# EAGLE design mlogger (EAGLE 9.6.2)
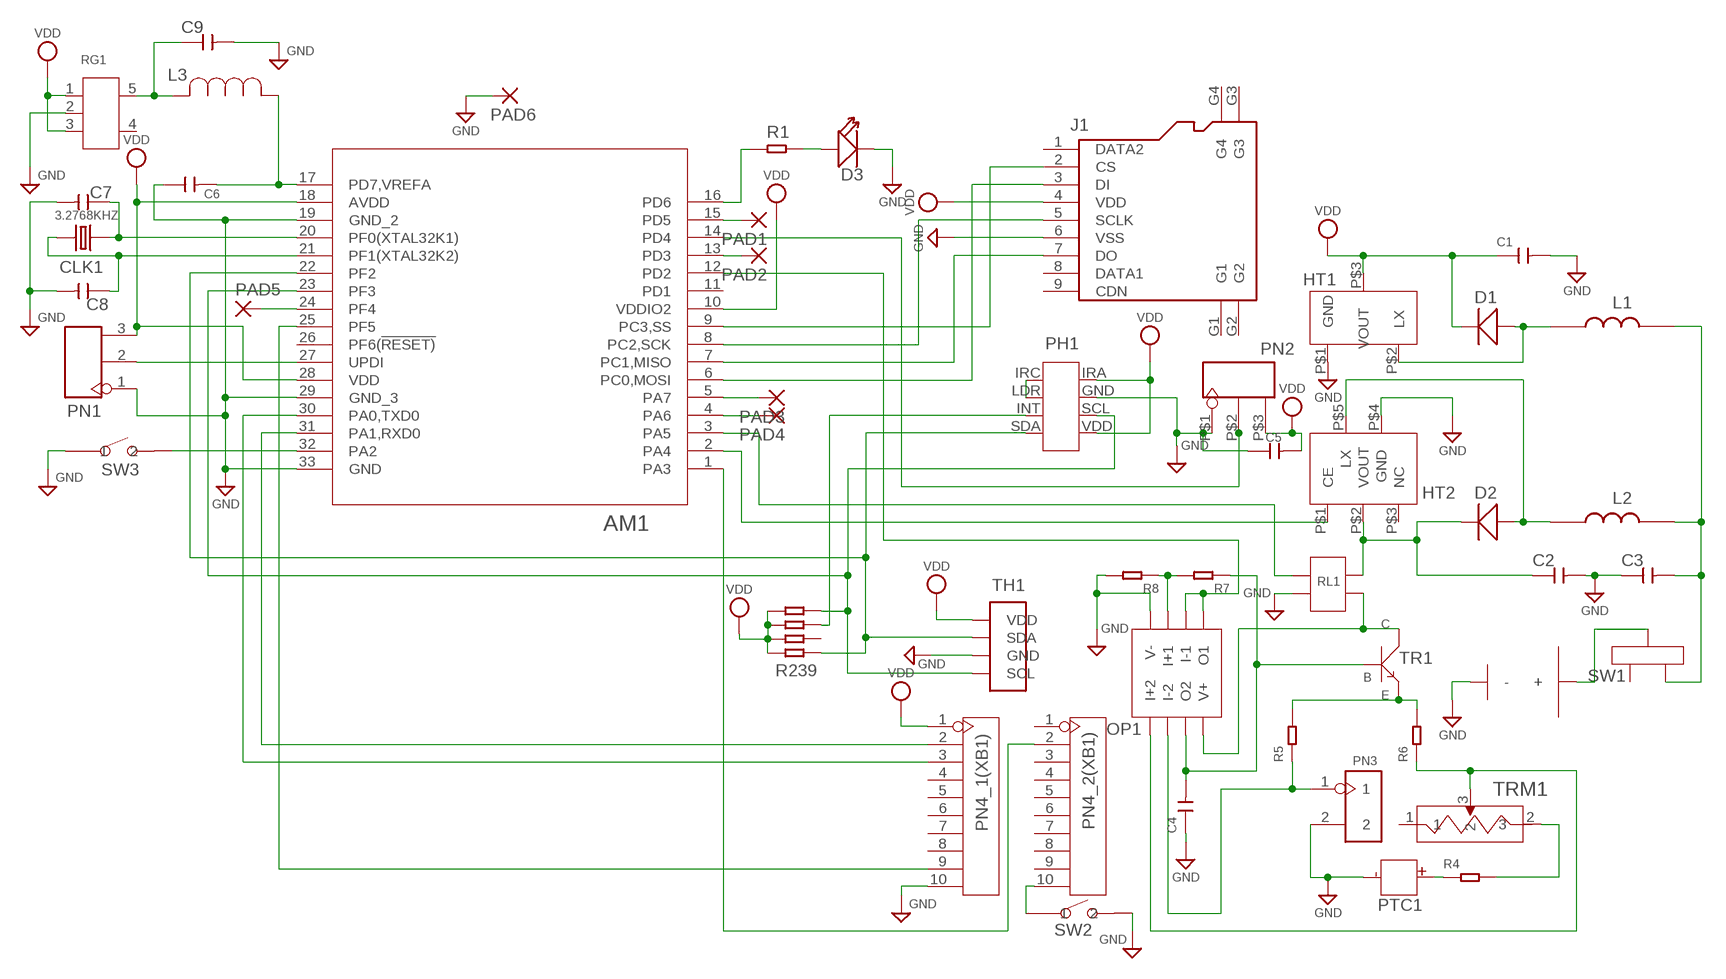
[diagram p0: schematic, sheet 1]

## Parts
AM1  AVR64DB32-I/RXBVQFN32_RXB_MCH  [VQFN32_RXB_MCH]
BB1  BH321  [BH321]
C1  MURATA_0603  [C0603]
C2  MURATA_0603  [C0603]
C3  MURATA_0603  [C0603]
C4  MURATA_0603  [C0603]
C5  MURATA_0603  [C0603]
C6  MURATA_0603  [C0603]
C7  MURATA_0603  [C0603]
C8  MURATA_0603  [C0603]
C9  MURATA_0603  [C0603]
CLK1  3.2768KHZ  SMD-CRYSTAL-32.768KHZ-12.5PF-20PPM-90K(2P-L2.0X1.2MM)  [X2-SMD-L2.0X1.2X0.55MM]
D1  20V-1A  SMD-DIODE-SCHOTTKY-20V-1A(SOD-123)  [SOD-123]
D2  20V-1A  SMD-DIODE-SCHOTTKY-20V-1A(SOD-123)  [SOD-123]
D3  OSHR1608C1A  [C0603]
HT1  HT77XXSOT23  [HT77XXSOT23]
HT2  HT77XXSOT25  [HT77XXSOT25]
J1  MICROSD-9P  MICRO-SD-CARD-HOLDER-9P  [MICRO-SD9+4P-SMD-16.1X14.5X1.85MM]
L1  303010168_47UM_5X5MM  [L2018]
L2  303010168_47UM_5X5MM  [L2018]
L3  LBR2012T100KIND_TAIYO_LBR2012_TAY  [IND_TAIYO_LBR2012_TAY]
OP1  NJM4565  [NJM4565]
PAD1  1,6/0,8  [1,6/0,8]
PAD2  1,6/0,8  [1,6/0,8]
PAD3  1,6/0,8  [1,6/0,8]
PAD4  1,6/0,8  [1,6/0,8]
PAD5  1,6/0,8  [1,6/0,8]
PAD6  1,6/0,8  [1,6/0,8]
PH1  VCNL4030X01  [VCNL4030X01]
PN1  3p-2.54  DIP-BLACK-MALE-HEADER-VERT(3P-2.54)  [H3-2.54]
PN2  B3B-PH-K-S  [B3B-PH-K-S]
PN3  2p-2.54  DIP-BLACK-ROUND-FEMALE-HEADER-VERT(2P-2.54)  [H2-2.54]
PN4_1(XB1)  10p-2.0  DIP-BLACK-FEMALE-HEADER-VERT(10P-2.0)  [H10-2.0]
PN4_2(XB1)  10p-2.0  DIP-BLACK-FEMALE-HEADER-VERT(10P-2.0)  [H10-2.0]
PTC1  TFPT1206  [TFPT1206]
R1  RES_0603  [R0603]
R4  RES_0603  [R0603]
R5  RES_0603  [R0603]
R6  RES_0603  [R0603]
R7  RES_0603  [R0603]
R8  RES_0603  [R0603]
R239  R1005X4  [R1005X4]
RG1  TCR2EF20SOT-25___(SMV)_TOS  [SOT-25___(SMV)_TOS]
RL1  CPC1002N  [CPC1002N]
SW1  SS-12D00G3  [SS-12D00G3]
SW2  TVAF06-A020B-R  [TVAF06-A020B-R]
SW3  TVAF06-A020B-R  [TVAF06-A020B-R]
TH1  AHT20  [AHT20]
TR1  MMBTA42  [MMBTA42]
TRM1  TC33X-1-103EIND_1-103E-L  [IND_1-103E-L]

## Nets
ADC0: AM1.14(PD4) PN2.P$2
ADC2 [PWR]: AM1.12(PD2) OP1.P$1(O1) OP1.P$2(I-1)
CTS: AM1.1(PA3) PN4_2(XB1).2
GADC1: AM1.24(PF4) PAD5.1(P)
GADC2: AM1.15(PD5) PAD1.1(P)
GADC3: AM1.13(PD3) PAD2.1(P)
GND [GND]: AM1.19(GND_2) AM1.29(GND_3) AM1.33(GND) BB1.V-(-) C1.2 C2.2 C3.1 C4.1 C5.1 C6.1 C7.2 C8.2 C9.2 D3.2(-) HT1.P$1(GND) HT2.P$4(GND) J1.6(VSS) OP1.P$4(V-) PAD6.1(P) PH1.GND PN1.1 PN2.P$1 PN3.2 PN4_1(XB1).10 PTC1.P$1 R8.2 RG1.2 RL1.GND SW2.P$2 SW3.P$1 TH1.P$5(GND)
INT: PH1.INT R239.4
MISO: AM1.7(PC1,MISO) J1.7(DO)
MOSI: AM1.6(PC0,MOSI) J1.3(DI)
N$1: R4.2 TRM1.2
N$2: AM1.20(PF0(XTAL32K1)) C7.1 CLK1.1
N$3: PN4_2(XB1).10 SW2.P$1
N$4: AM1.16(PD6) R1.2
N$5: AM1.32(PA2) SW3.P$2
N$6: AM1.21(PF1(XTAL32K2)) C8.1 CLK1.2
N$7: C9.1 L3.2 RG1.5
N$10: D3.1(+) R1.1
N$12: AM1.5(PA7) PAD3.1(P)
N$13: AM1.4(PA6) PAD4.1(P)
N$14: BB1.V+(+) SW1.P$1(P2)
N$20: PH1.IRC PH1.LDR
N$23: AM1.2(PA4) HT2.P$1(CE)
N$24: AM1.3(PA5) RL1.+
N$28: PTC1.P$2 R4.1
P$1 [PWR]: OP1.P$6(I-2) PN3.1 R5.1
P$2 [PWR]: R5.2 R6.2 TR1.P$2
P$3 [PWR]: OP1.P$5(I+2) R6.1 TRM1.3
P$5 [PWR]: C4.2 OP1.P$7(O2) R7.1 TR1.P$1
P$6 [PWR]: OP1.P$8(V+) RL1.DC- TR1.P$3(C)
P$7 [PWR]: OP1.P$3(I+1) R7.2 R8.1
P$10 [PWR]: D2.+ HT2.P$5(LX) L2.P$1
P$11 [PWR]: C3.2 L1.P$2 L2.P$2 SW1.P$2(P1)
P$13 [PWR]: D1.+ HT1.P$2(LX) L1.P$1
RXD: AM1.31(PA1,RXD0) PN4_1(XB1).2
SCK: AM1.8(PC2,SCK) J1.5(SCLK)
SCL: AM1.23(PF3) PH1.SCL R239.2 TH1.P$3(SCL)
SDA [PWR]: AM1.22(PF2) PH1.SDA R239.8 TH1.P$4(SDA)
SLP: AM1.25(PF5) PN4_1(XB1).9
SS: AM1.9(PC3,SS) J1.2(CS)
TXD: AM1.30(PA0,TXD0) PN4_1(XB1).3
UPDI: AM1.27(UPDI) PN1.2
V5 [PWR]: C2.1 D2.- HT2.P$2(VOUT) RL1.DC+
VDD [PWR]: AM1.10(VDDIO2) AM1.18(AVDD) AM1.28(VDD) C1.1 C5.2 D1.- HT1.P$3(VOUT) J1.4(VDD) PH1.IRA PH1.VDD PN1.3 PN2.P$3 PN4_1(XB1).1 R239.1 R239.3 R239.5 R239.7 RG1.1 RG1.3 TH1.P$2(VDD)
VREFA: AM1.17(PD7,VREFA) C6.2 L3.1
Unconnected: AM1.11(PD1) AM1.26(PF6(!RESET)) HT2.P$3(NC) J1.1(DATA2) J1.8(DATA1) J1.9(CDN) J1.G1 J1.G2 J1.G3 J1.G4 PN4_1(XB1).4 PN4_1(XB1).5 PN4_1(XB1).6 PN4_1(XB1).7 PN4_1(XB1).8 PN4_2(XB1).1 PN4_2(XB1).3 PN4_2(XB1).4 PN4_2(XB1).5 PN4_2(XB1).6 PN4_2(XB1).7 PN4_2(XB1).8 PN4_2(XB1).9 R239.6 RG1.4 SW1.P$3(P3) TRM1.1

## Notes on the sheet
- PH1
- TH1

## Library data of the parts
AM1 = MyParts:AVR64DB32-I/RXB; COPYRIGHT: Copyright (C) 2022 Ultra Librarian. All rights reserved.; MANUFACTURER_PART_NUMBER: AVR64DB32-I/RXB; MFR_NAME: Microchip
BB1 = MyParts:BH321
C1-C9 = MyParts:MURATA_0603
CLK1 = Seeed-Crystal Oscillator:SMD-CRYSTAL-32.768KHZ-12.5PF-20PPM-90K(2P-L2.0X1.2MM): 306010020; MPN: FC-12M
D1 D2 = Seeed-Diode:SMD-DIODE-SCHOTTKY-20V-1A(SOD-123): 304020034; MPN: B5819W
D3 = MyParts:OSHR1608C1A
HT1 = MyParts:HT77XXSOT23
HT2 = MyParts:HT77XXSOT25
J1 = OPL_Connector:MICRO-SD-CARD-HOLDER-9P: 320090008
L1 L2 = Seeed-OPL-2017-01-Inductor-Akita:303010168_47UM_5X5MM: SPD4D28-470M, SMD Inductor 47uH-±20%-450mA;4.8*4.8*3.2mm, SKU: 303010168
L3 = MyParts:LBR2012T100K
OP1 = MyParts:NJM4565
PAD1-PAD6 = wirepad:1,6/0,8: THROUGH-HOLE PAD
PH1 = MyParts:VCNL4030X01
PN1 = MyParts:DIP-BLACK-MALE-HEADER-VERT(3P-2.54): 320020079
PN2 = MyParts:B3B-PH-K-S
PN3 = MyParts:DIP-BLACK-ROUND-FEMALE-HEADER-VERT(2P-2.54): 320030050; MPN: RF130-1023ABS0741
PN4_1(XB1) PN4_2(XB1) = OPL_Connector:DIP-BLACK-FEMALE-HEADER-VERT(10P-2.0): 320030009; MPN: F243-1110A1BSUA1
PTC1 = MyParts:TFPT1206
R1 R4-R8 = MyParts:RES_0603: 301012041
R239 = MyParts:R1005X4
RG1 = MyParts:TCR2EF20
RL1 = MyParts:CPC1002N
SW1 = MyParts:SS-12D00G3
SW2 SW3 = MyParts:TVAF06-A020B-R
TH1 = MyParts:AHT20
TR1 = MyParts:MMBTA42
TRM1 = MyParts:TC33X-1-103E

## Net classes
0 default: width 0.254 mm
1 GND: width 0.254 mm
2 PWR: width 0.254 mm

## Board
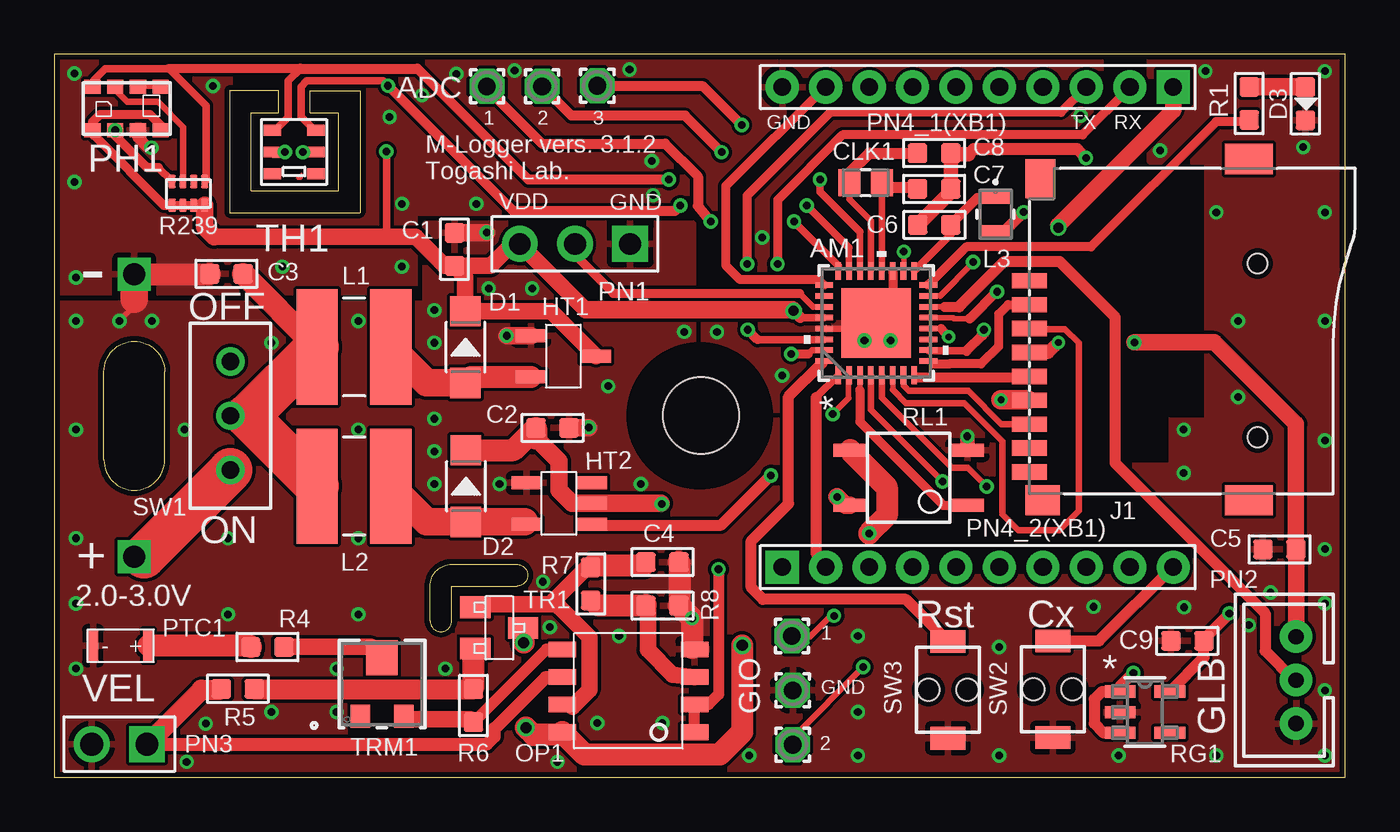
[diagram p1: board, top side]
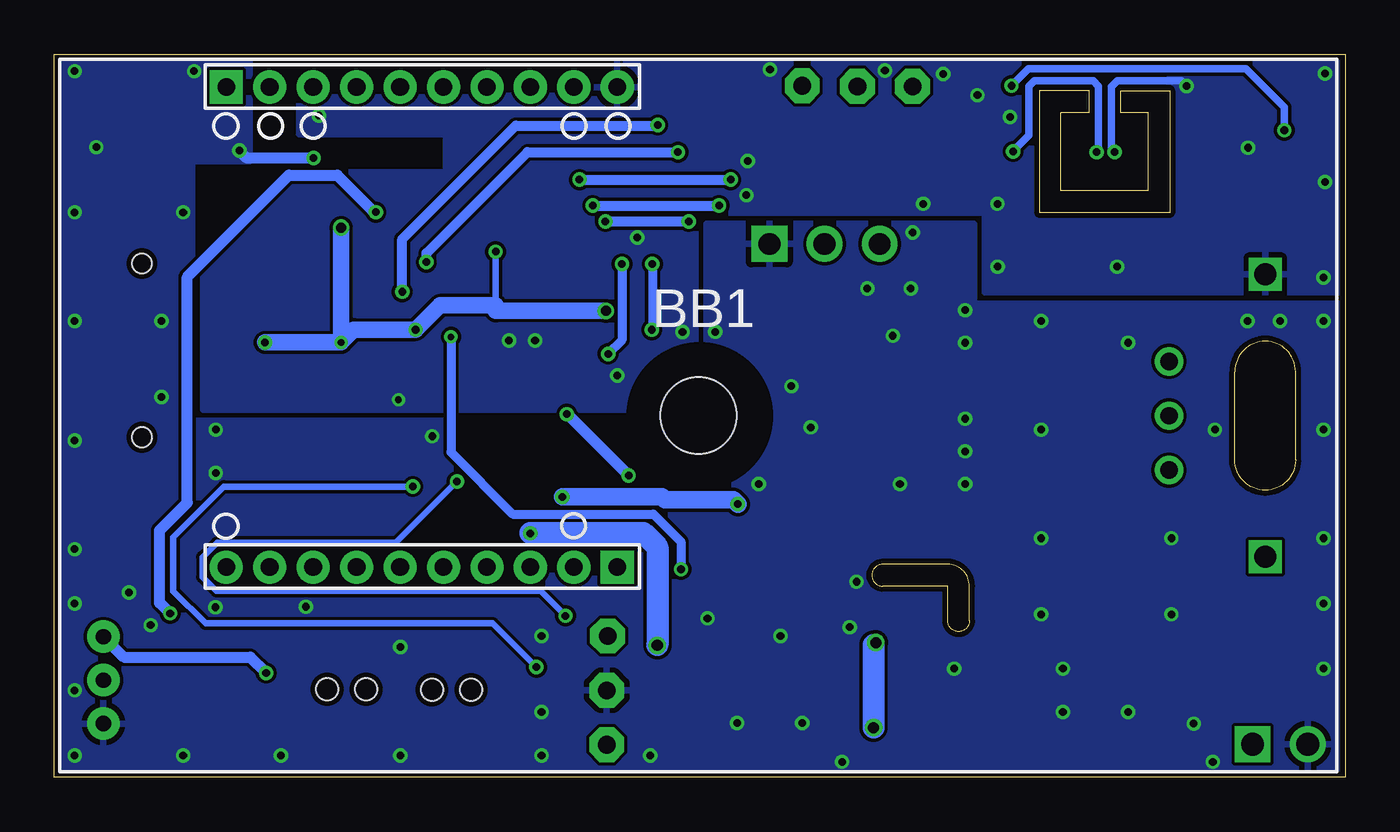
[diagram p2: board, bottom side, seen from below]

Size 59.44 x 33.27 mm. Coordinates in mm from the lower left corner, seen from the top.
Outline: 0,0 59.44,0 59.44,33.27 0,33.27 0,0
Outline: 8.08,31.6 8.08,25.98 14.07,25.98 14.07,31.6 11.79,31.6 11.79,30.58 13.08,30.58 13.08,27 9.07,27 9.07,30.58 10.34,30.58 10.34,31.6 8.08,31.6
Outline: 2.29,14.61 2.29,18.67 arc-180 5.08,18.67 5.08,14.61 arc-180 2.29,14.61
Outline: 17.3,8.8 arc-90 18.3,9.8 21.3,9.8 arc-180 21.3,8.8 18.3,8.8 18.3,7.2 arc-180 17.3,7.2 17.3,8.8
Copper layers (1*16): Top 0.035mm / dielectric 1.5mm / Bottom 0.035mm
Design rules "SeeedStudio_2layer_DRU_no_angle_20140221 *": minimum track width 6mil, minimum drill 12mil, track to track 6mil, track to pad 6mil, pad to pad 6mil, via to via 6mil, smd to smd 0mil, copper to edge 10mil, drill to drill 10mil, minimum pad ring 10mil, minimum via ring 6mil, stop-mask expansion 2mil, vias tented up to drill 30mil, thermal gap 10mil
tRestrict: area 26.4,13.3 to 33,19.9
bRestrict: area 26.4,13.3 to 33,19.9

### Footprints (pad centres in the part's own frame; a part is rotated, then mirrored left to right if it is on the bottom)
VQFN32_RXB_MCH = smd 0.813 x 0.254: 1 -2.4,1.75; 2 -2.4,1.25; 3 -2.4,0.75; 4 -2.4,0.25; 5 -2.4,-0.25; 6 -2.4,-0.75; 7 -2.4,-1.25; 8 -2.4,-1.75; 17 2.4,-1.75; 18 2.4,-1.25; 19 2.4,-0.75; 20 2.4,-0.25; 21 2.4,0.25; 22 2.4,0.75; 23 2.4,1.25; 24 2.4,1.75 | smd 0.254 x 0.813: 9 -1.75,-2.4; 10 -1.25,-2.4; 11 -0.75,-2.4; 12 -0.25,-2.4; 13 0.25,-2.4; 14 0.75,-2.4; 15 1.25,-2.4; 16 1.75,-2.4; 25 1.75,2.4; 26 1.25,2.4; 27 0.75,2.4; 28 0.25,2.4; 29 -0.25,2.4; 30 -0.75,2.4; 31 -1.25,2.4; 32 -1.75,2.4 | smd 3.2 x 3.2: 33 0,0
BH321 = drill 1 square: V+ 55.5,9.9; V- 55.5,22.9 | hole 3.5: 29.4,16.4
C0603 = smd 0.889 x 0.889: 1 0,0.762; 2 0,-0.762
X2-SMD-L2.0X1.2X0.55MM = smd 1 x 1.25: 1 -0.75,0; 2 0.75,0
SOD-123 = smd 1.397 x 1.397: + -1.651,0; - 1.651,0
HT77XXSOT23 = smd 0.6 x 1.4: P$1 0,-0.5; P$2 1.9,-0.5; P$3 0.95,2.5
HT77XXSOT25 = smd 0.6 x 1.4: P$1 0,-0.5; P$2 0.95,-0.5; P$3 1.9,-0.5; P$4 1.9,2.5; P$5 0,2.5
MICRO-SD9+4P-SMD-16.1X14.5X1.85MM = smd 1.6 x 0.7: 1 0,2.25; 2 0,1.15; 3 0,0.05; 4 0,-1.05; 5 0,-2.15; 6 0,-3.25; 7 0,-4.35; 8 0,-5.45; 9 0,-6.55 | smd 1.6 x 1.4: G1 0.6,-7.85 | smd 2.2 x 1.4: G2 10.1,-7.85; G3 10.1,7.85 | smd 1.4 x 1.8: G4 0.5,6.95 | hole 0.9: 10.5,-4.95; 10.5,3.05
L2018 = smd 1.9 x 5.3: P$1 -1.7,0; P$2 1.7,0
IND_TAIYO_LBR2012_TAY = smd 0.61 x 1.448: 1 -0.8,0; 2 0.8,0
NJM4565 = smd 0.72 x 1.27: P$1 0,0; P$2 1.27,0; P$3 2.54,0; P$4 3.81,0; P$5 3.81,6.1; P$6 2.54,6.1; P$7 1.27,6.1; P$8 0,6.1
1,6/0,8 = drill 0.813 pad 1.6 octagon: 1 0,0
VCNL4030X01 = smd 0.75 x 0.65: GND -0.525,1.005; INT 0.525,-1.005; IRA -1.575,1.005; IRC -1.575,-1.005; LDR -0.525,-1.005; SCL 0.525,1.005; SDA 1.575,-1.005; VDD 1.575,1.005
H3-2.54 = drill 1 pad 1.651 square: 1 0,2.54 | drill 1 pad 1.651: 2 0,0; 3 0,-2.54
B3B-PH-K-S = drill 0.7 pad 1.5: P$1 -2,0; P$2 0,0; P$3 2,0
H2-2.54 = drill 1.05 pad 1.651 square: 1 0,1.27 | drill 1.05 pad 1.651: 2 0,-1.27
H10-2.0 = drill 0.813 pad 1.524 square: 1 0,9 | drill 0.813 pad 1.524: 2 0,7; 3 0,5; 4 0,3; 5 0,1; 6 0,-1; 7 0,-3; 8 0,-5; 9 0,-7; 10 0,-9
TFPT1206 = smd 0.5 x 1.5: P$1 0,0; P$2 2.55,0
R0603 = smd 0.889 x 0.889: 1 0,0.762; 2 0,-0.762
R1005X4 = smd 0.33 x 0.6: 1 -0.75,-0.55; 2 -0.75,0.55; 3 -0.25,-0.55; 4 -0.25,0.55; 5 0.25,-0.55; 6 0.25,0.55; 7 0.75,-0.55; 8 0.75,0.55
SOT-25___(SMV)_TOS = smd 1.422 x 0.559: 1 -1.144,0.95; 2 -1.144,0; 3 -1.144,-0.95; 4 1.144,-0.95; 5 1.144,0.95
CPC1002N = smd 0.6 x 1.54: + -1.27,-2.7; DC+ -1.27,2.7; DC- 1.27,2.7; GND 1.27,-2.7
SS-12D00G3 = drill 0.8: P$1 -2.5,0; P$2 0,0; P$3 2.5,0
TVAF06-A020B-R = smd 1.05 x 1.6: P$1 -2.225,0; P$2 2.225,0 | hole 1: 0,0.9; 0,-0.9
AHT20 = smd 0.8 x 0.5: P$1 0,2; P$2 0,1; P$3 0,0; P$4 2,0; P$5 2,1; P$6 2,2
MMBTA42 = smd 1 x 1.4: P$1 0,0; P$2 1.9,0; P$3 0.95,2.2
IND_1-103E-L = smd 0.889 x 1.041: 1 -1,-1.486; 3 1,-1.486 | smd 1.448 x 1.6: 2 0,1.206

### Placement (x,y rotation side)
AM1  37.85,20.9 90 top
BB1  59.18,0.25 0 bottom
C1  18.42,24.3 180 top
C2  22.94,16.08 90 top
C3  7.93,23.17 90 top
C4  28,9.9 270 top
C5  56.41,10.49 90 top
C6  40.52,25.43 90 top
C7  40.51,27.08 90 top
C8  40.51,28.73 90 top
C9  52.17,6.27 270 top
CLK1  37.36,27.36 180 top
D1  18.93,19.8 90 top
D2  18.95,13.4 90 top
D3  57.6,31 0 top
HT1  22.44,20.33 270 top
HT2  24.24,11.65 90 top
J1  44.9,20.6 0 top
L1  13.8,19.8 180 top
L2  13.8,13.4 180 top
L3  43.33,25.91 270 top
OP1  29.48,2.07 90 top
PAD1  22.46,31.8 0 top
PAD2  25,31.83 0 top
PAD3  34,1.5 0 top
PAD4  33.96,6.5 0 top
PAD5  19.92,31.8 0 top
PAD6  34,4 0 top
PH1  3.33,30.78 180 top
PN1  23.97,24.55 270 top
PN2  57.18,4.47 90 top
PN3  2.99,1.52 270 top
PN4_1(XB1)  42.52,31.77 270 top
PN4_2(XB1)  42.52,9.67 90 top
PTC1  1.78,6.05 0 top
R1  55.02,31.01 0 top
R4  9.81,6 90 top
R5  8.45,4.07 90 top
R6  19.3,3.3 180 top
R7  24.7,8.9 0 top
R8  28,7.9 90 top
R239  6.17,26.87 0 top
RG1  50.22,3 0 top
RL1  39.33,13.78 90 top
SW1  8.11,16.64 90 top
SW2  45.97,4.05 270 top
SW3  41.15,4.03 90 top
TH1  12.04,29.78 180 top
TR1  19.38,7.83 270 top
TRM1  15.09,4.29 0 top

### Tracks (layer width: path | path; a pad name or v marks a point on that pad's centre or on a via)
ADC0
  Top 0.254: AM1.14 40.99,21.65 | 57.1,4.47 PN2.P$2
  Top 0.457: 40.99,21.65 41.65,21.65
  Top 0.508: 41.65,21.65 43.76,23.75 46.28,23.75 48.84,21.18 48.84,14.45 55.75,7.54 55.75,5.82 57.1,4.47
ADC2  (via drill 0.3, 0.35)
  Top 0.254: 40.84,20.65 AM1.12 | OP1.P$2 29.49,3.35 30.12,3.35
  Top 0.406: v41.17,20.27 40.84,20.65
  Top 0.508: v30.58,9.58 30.58,3.81 30.12,3.35 | OP1.P$1 OP1.P$2
  Bottom 0.406: v41.17,20.27 41.17,14.96 38.33,12.12 31.85,12.12 30.58,10.85 v30.58,9.58
CTS
  Top 0.356: 35.08,17.48 AM1.1
  Top 0.508: 35.08,17.48 35.08,10.3 PN4_2(XB1).2
GADC1  (via drill 0.35)
  Top 0.254: 36.1,23.54 AM1.24
  Top 0.356: v34.06,25.58 36.1,23.54
  Top 0.457: v30.23,25.58 29.64,26.3 29.64,27.65 28.12,29.16 22.45,29.16 19.92,31.7 PAD5.1
  Bottom 0.457: v30.23,25.58 v34.06,25.58
GADC2  (via drill 0.35)
  Top 0.254: AM1.15 40.26,22.17 40.79,22.17
  Top 0.305: v42.3,23.71 42.3,23.68 40.79,22.17
  Top 0.457: v30.72,28.77 29.04,30.45 23.81,30.45 PAD1.1
  Bottom 0.457: v42.3,23.71 42.3,24.12 37.66,28.77 v30.72,28.77
GADC3  (via drill 0.35)
  Top 0.254: 42.15,21.11 41.43,21.11 41.41,21.14 40.78,21.14 40.76,21.15 AM1.13 | v43.41,22.35 43.4,22.36
  Top 0.457: 43.4,22.36 42.15,21.11 | v31.65,30.02 29.87,31.8 25.02,31.8 PAD2.1
  Bottom 0.457: v43.41,22.35 43.41,24.77 38.19,30 31.67,30 v31.65,30.02
GND  (via drill 0.3, 0.35)
  Top 0.254: 29.36,5.96 OP1.P$4 | 28.85,7.82 R8.2 | AM1.29 | 38.61,21.64 37.9,20.93 AM1.33 | 44.81,17.37 J1.6 | AM1.19 38.61,23.27 | 41.27,26.94 C7.2 | 41.33,28.68 C8.2 | AM1.33 37.85,20.88 37.62,20.65 | AM1.33 37.3,20.36 v37.3,20.1 | 24.59,16.08 v24.61,16.1 | v20.84,20.33 v20.83,20.32 | 3.68,22 3.68,21.68 v3,21
  Top 0.305: 37.62,20.65 AM1.29
  Top 0.406: 38.61,23.27 38.61,21.64
  Top 0.508: v4.47,28.98 4.33,28.98 3.85,29.45 PH1.GND | TH1.P$5 v10.62,28.78 | 42.09,28.68 42.32,28.91 | 47.09,28.91 v47.5,28.5
  Top 0.559: 47.09,28.91 42.32,28.91
  Top 0.66: v42.04,15.7 RL1.GND | C6.1 41.27,26.94 | C7.2 C8.2 | 41.33,28.68 42.09,28.68
  Top 0.813: C2.2 24.59,16.08 | HT1.P$1 v20.84,20.33 | C1.2 18.43,25.07 v19.91,25.07
  Top 0.889: v43.59,17.37 44.81,17.37
  Top 1.016: C4.1 28.78,9.88 28.78,7.92 R8.2 | 29.36,5.96 v29.36,7.32 28.85,7.82 | C3.1 7.16,23.15 BB1.V-
  Top 1.27: BB1.V- 3.68,22
  Bottom 0.254: 50.52,28.5 50.58,28.5 | v7.31,31.82 7.54,32.05
  Bottom 0.356: v10.62,28.78 10.77,28.93 10.77,31.78 10.5,32.05 7.54,32.05
  Bottom 0.508: v47.5,28.5 50.52,28.5 | 50.58,28.5 v50.92,28.84
  other vias: 22.81,6.91 38.5,20.1 6.1,0.71 23.16,0.71 1,23 14,21 14,16 14,11 8,11 1,11 1,16 1,21 6,16 13,5 13,3 6.97,2.47 18,5 8,7.5 14,7.5 1,8 1,5 10,3 25,2.5 26,6.5 28,2.5 29,20.5 20,22.5 22,22.5 27,13.5 25.5,18 17.5,20 17.5,21.5 16,23.5 10.5,23.5 17.5,16.5 17.5,13.5 17.5,15 20.5,13.5 32,1 22.5,9 58.5,1 58.5,4 58.5,8 58.5,15.5 58.5,10.5 52,16 58.5,26 58.5,21 53.5,26 58.5,32.5 53,32.5 47.25,30.45 32.6,24.84 33.51,18.49 30.51,20.49 26.48,32.57 21.19,32.53 27.51,28.37 18.51,32.37 16.93,31.39 27.57,26.79 16.01,26.39 15.43,30.39 19.43,26.39 0.93,32.39 0.93,27.39 4.5,21 10,20 54.5,21 52,14 54.5,17.5 56,8.5 37,6.5 37,3 37,1 49,1 47.85,7.85 52.02,7.82 43.5,6 43.5,1 53.5,1 57.5,29 55,7
  pour Bottom: 0,21.79 17.09,21.79 17.09,25.48 29.41,25.48 29.41,16.41 53.09,16.41 53.09,28.35 50.44,28.35 50.44,33.27 59.44,33.27 59.44,0 0,0
  pour Top: 0,21.79 17.09,21.79 17.09,25.48 29.41,25.48 29.41,16.41 53.09,16.41 53.09,28.35 50.44,28.35 50.44,33.27 59.44,33.27 59.44,0 0,0
  pour Bottom: 0,33.27 0,22.33 16.59,22.33 16.59,25.98 29.92,25.98 29.92,16.92 52.58,16.92 52.58,27.84 41.4,27.84 41.4,29.59 48.16,29.59 48.16,33.27 14.07,33.27 14.07,25.98 8.08,25.98 8.08,33.27
  pour Top: 0,33.27 0,22.33 16.59,22.33 16.59,25.98 29.92,25.98 29.92,16.92 36.25,16.92 36.25,29.59 48.16,29.59 48.16,33.27 14.07,33.27 14.07,25.98 8.08,25.98 8.08,33.27
INT
  Top 0.254: 5.94,27.45 R239.4 | 2.93,31.51 PH1.INT
  Top 0.305: 5.94,27.45 5.94,29.92 4.78,31.09 3.35,31.09 2.93,31.51
MISO
  Top 0.254: 39.12,18.01 39.12,18.49 AM1.7 | J1.7
  Top 0.305: 39.12,18.01 39.34,17.78 42.08,17.78 43.62,16.24 J1.7
MOSI
  Top 0.254: 38.61,17.83 AM1.6 | 44.91,20.62 J1.3
  Top 0.305: 38.61,17.83 39.22,17.22 41.91,17.22 43.66,15.47 43.66,12.12 44.4,11.38 46.28,11.38 47.17,12.27 47.17,19.99 46.53,20.62 44.91,20.62
N$1
  Top 0.762: R4.2 14.59,6 TRM1.2
N$2
  Top 0.254: 38.1,23.37 AM1.20 | 39.69,27.13 C7.1
  Top 0.305: CLK1.1 38.1,23.37
  Top 0.508: 39.69,27.13 38.34,27.13 CLK1.1
N$3
  Top 0.254: 51.5,9.67 PN4_2(XB1).10
  Top 0.508: 51.5,9.67 48.1,6.28 SW2.P$1
N$4
  Top 0.254: 54.97,30.18 R1.2
  Top 0.406: AM1.16 40.25,22.67 41.99,24.41 47.73,24.41 53.49,30.18 54.97,30.18
N$5
  Top 0.254: 35.36,19.1 AM1.32
  Top 0.406: 35.36,19.07 35.36,19.1
  Top 0.508: 35.36,19.07 33.81,17.53 33.81,12.6 32.08,10.87 32.08,8.74 32.63,8.19 39.21,8.19 SW3.P$2
N$6
  Top 0.254: 37.59,23.37 AM1.21
  Top 0.305: 37.59,23.37 37.59,25.61 36.61,26.6 CLK1.2 36.61,27.81
  Top 0.508: 36.61,27.81 37.52,28.73 C8.1
N$7  (via drill 0.35)
  Top 0.254: 43.73,25.11 L3.2 | C9.1 52.93,6.36
  Top 0.508: v44.63,26.01 43.73,25.11 | v54.1,7.54 54.1,7.53 52.93,6.36 | RG1.5 52.93,5.52 C9.1
  Bottom 0.254: v54.1,7.54 v54.11,7.54 | v44.63,26.01 44.71,26.01
  Bottom 0.508: v54.11,7.54 54.59,8.02 54.59,11.37 53.31,12.64 53.31,23.03 48.63,27.71 46.41,27.71 44.71,26.01
N$10
  Top 0.254: 57.57,31.77 D3.1
  Top 0.813: R1.1 57.57,31.77
N$12  (via drill 0.35)
  Top 0.254: AM1.5
  Top 0.305: AM1.5 38.1,17.47 41.32,14.25 42.06,14.25 v42.93,13.39 | PAD3.1 34,1.83 v37.24,5.07
  Bottom 0.305: v37.24,5.07 39.25,7.08 52.47,7.08 53.95,8.56 53.95,11.06 51.63,13.38 42.99,13.38 42.99,13.39 v42.93,13.39
N$13  (via drill 0.35)
  Top 0.305: AM1.4 37.6,16.91 v40.89,13.61 | v35.9,7.43 35.75,7.43 34.82,6.5 PAD4.1
  Bottom 0.305: v40.89,13.61 43.72,10.79 51.95,10.79 52.61,10.13 52.61,9.21 51.97,8.58 37.05,8.58 v35.9,7.43
N$14
  Top 1.27: BB1.V+ 4.13,10.15
  Top 2.032: 4.13,10.15 SW1.P$1
N$20
  Top 0.254: PH1.LDR 3.86,31.8 4.88,31.8 PH1.IRC
N$23  (via drill 0.35)
  Top 0.254: AM1.2 36.57,18.48 36.57,17.44 | HT2.P$1 24.8,11.6
  Top 0.305: v35.84,16.71 36.57,17.44
  Top 0.508: 24.8,11.6 30.7,11.6 v32.99,13.89
  Bottom 0.508: v35.84,16.71 35.81,16.71 v32.99,13.89
N$24
  Top 0.254: AM1.3 37.1,17.84 37.08,17.83
  Top 0.406: RL1.+ 40.93,12.51 37.08,16.36 37.08,17.83
N$28
  Top 1.016: R4.1 8.99,6.05 PTC1.P$2
P$1
  Top 0.254: 7.68,4.04 R5.1 | PN3.1 | 23.37,4.6 OP1.P$6
  Top 0.61: 23.37,4.6 22.63,4.6 20.27,2.23 20.27,1.88 19.91,1.52 PN3.1
  Top 0.914: 7.68,4.04 6.78,4.04 PN3.1
P$2
  Top 0.254: R5.2 9.25,4.04 | 19.3,5.89 TR1.P$2 | 19.3,4.17 R6.2
  Top 0.762: R6.2 19.28,4.04
  Top 0.914: 19.28,4.04 9.25,4.04
  Top 1.016: 19.3,4.17 19.3,5.89
P$3
  Top 0.254: R6.1 | TRM1.3 16.23,2.67
  Top 0.508: OP1.P$5 23.37,5.89 22.66,5.89 R6.1
  Top 0.762: R6.1 19.17,2.67 16.23,2.67
P$5
  Top 0.254: 27.13,9.75 27.23,9.86 C4.2 | 23.85,3.25 23.4,3.25 OP1.P$7 | 23.26,7.83 23.02,7.83 23.02,7.95 23.02,8.15 | R7.1 24.79,9.75
  Top 0.762: 23.85,3.25 24.64,4.04 24.64,6.45 23.26,7.83 | 23.02,7.95 19.51,7.95 TR1.P$1 | R7.1 24.52,9.66 23.02,8.15
  Top 1.016: 24.79,9.75 27.13,9.75
P$6  (via drill 0.35, 0.51)
  Top 0.254: 21.61,6.84 TR1.P$3
  Top 0.813: OP1.P$8 23.25,1.95
  Top 1.016: v31.67,6.07 31.67,2.08 30.63,1.04 24.41,1.04 OP1.P$8 | 23.25,1.95 22.06,1.95 v21.72,2.29 | v21.61,6.2 21.61,6.84 | RL1.DC- 38.33,13.36 38.33,12.04 v37.52,11.23
  Bottom 0.254: v31.67,6.07 31.66,6.08 | v37.52,11.23 37.52,11.24
  Bottom 0.813: v21.61,6.2 21.72,6.1
  Bottom 1.016: 21.72,6.1 v21.72,2.29 | 31.66,6.08 31.66,10.6 32.31,11.24 37.52,11.24
P$7
  Top 0.254: 24.99,7.92 24.79,8.13 R7.2 | 27.23,7.92 R8.1 27.33,7.82
  Top 0.762: 27.33,7.82 27.33,5.87 28.47,4.72 OP1.P$3
  Top 1.016: 24.99,7.92 27.23,7.92
P$10
  Top 0.254: 21.65,11.75 HT2.P$5
  Top 1.27: 21.65,11.75 D2.+ 17.15,11.75 L2.P$1
P$11
  Top 0.254: SW1.P$2 8.86,16.64
  Top 1.016: L1.P$2 12.04,19.82 C3.2
  Top 1.27: SW1.P$2 8.94,16.64
  Top 2.032: 8.86,16.64 L2.P$2 | 8.94,16.64 L1.P$2
P$13
  Top 0.254: D1.+ 19.21,18.43
  Top 1.016: 19.21,18.43 HT1.P$2
  Top 1.27: L1.P$1 17.15,18.15 D1.+
RXD  (via drill 0.35)
  Top 0.254: 49.48,31.7 PN4_1(XB1).2
  Top 0.305: 34.72,19.48 34.89,19.65 AM1.31
  Top 0.406: 49.48,31.7 47.35,29.57 36.3,29.57 33.3,26.57 v33.3,23.62 | v33.93,19.48 34.72,19.48
  Bottom 0.406: v33.3,23.62 33.3,20.12 v33.93,19.48
SCK
  Top 0.254: 39.62,18.49 AM1.8 | 44.81,18.39 J1.5
  Top 0.356: 39.73,18.39 39.62,18.49
  Top 0.457: 44.81,18.39 39.73,18.39
SCL  (via drill 0.35)
  Top 0.254: 2.8,29.53 PH1.SCL | 11.98,29.78 TH1.P$3
  Top 0.305: 36.6,24.36 AM1.23
  Top 0.356: v15.37,31.83 15.14,32.05 11.63,32.05 11.35,31.78 11.35,30.4 11.98,29.78 | 36.6,24.36 v34.65,26.31 | R239.2 4.79,28.05
  Top 0.406: 4.79,28.05 4.28,28.05 2.8,29.53
  Top 0.457: v15.37,31.83 v15.38,31.83 21.14,26.06 28.58,26.06 v28.83,26.31
  Bottom 0.356: v15.37,31.83 14.58,32.61 4.57,32.61 2.8,30.84 PH1.SCL
  Bottom 0.457: v34.65,26.31 v28.83,26.31
  other vias: 2.8,29.78
SDA  (via drill 0.35)
  Top 0.254: 1.83,32.11 1.83,31.8 PH1.SDA | R239.8 6.99,27.49 | TH1.P$4 10.16,29.78
  Top 0.305: 37.1,25.11 AM1.22
  Top 0.356: 1.83,32.11 2.34,32.61 5.28,32.61 6.99,30.91 6.99,27.49 | v35.26,27.51 35.26,26.95 37.1,25.11 | 10.16,29.78 10.77,30.38 10.77,32.05 11.34,32.61
  Top 0.406: 11.34,32.61 5.28,32.61
  Top 0.457: 11.34,32.61 16.72,32.61 21.83,27.51 v28.3,27.51
  Bottom 0.457: v35.26,27.51 v28.3,27.51
SLP
  Top 0.406: PN4_1(XB1).9 35.48,31.77 30.91,27.2 30.91,23.57 31.57,22.91 35.19,22.91 AM1.25
SS
  Top 0.254: AM1.9 40.46,19.02
  Top 0.406: J1.2 43.92,21.75 43.48,21.31 43.48,19.84 42.67,19.02 41.2,19.02 40.46,19.02
TXD  (via drill 0.35)
  Top 0.254: AM1.30 35.43,20.14
  Top 0.356: 35.43,20.14 32.38,20.14
  Top 0.406: PN4_1(XB1).3 46.36,30.61 35.74,30.61 31.9,26.77 v31.9,23.62 | 32.38,20.14 v31.93,20.6
  Bottom 0.406: v31.9,23.62 31.9,20.63
  Bottom 0.508: v31.93,20.6 31.9,20.63
UPDI
  Top 0.254: 34.94,21.65 AM1.27
  Top 0.305: 34.94,21.65 34.31,22.28
  Top 0.406: 34.31,22.28 25.75,22.28 23.97,24.05 PN1.2
V5  (via drill 0.35)
  Top 0.254: 27.94,12.6 v27.96,12.57 | HT2.P$2 24.73,12.62
  Top 0.813: RL1.DC+ 36.43,12.51 v36.04,12.9 | HT2.P$2 27.94,12.6 | 24.73,12.62 23.83,12.62 23.23,13.22 23.23,14.54 22.17,15.6
  Top 1.016: 22.17,15.6 C2.1 21.14,15.05 D2.-
  Bottom 0.813: v36.04,12.9 31.45,12.9 31.32,12.78 28.17,12.78 v27.96,12.57
VDD  (via drill 0.3, 0.35, 0.45, 0.46)
  Top 0.254: 1.83,29.54 1.83,29.77 PH1.VDD 1.77,29.79 | D1.- | v39.12,24.19 39.12,23.32 AM1.18
  Top 0.356: AM1.28 34.34,21.15 | 42.01,19.63 40.27,19.63 AM1.10 | v11.45,28.78 v11.45,28.77 | PH1.IRA 4.9,30 | v15.29,28.8 15.29,24.87
  Top 0.406: 1.83,29.54 5.05,26.32 R239.1 R239.3 R239.5 R239.7 | 1.77,29.79 1.77,30.17 2.11,30.51 4.39,30.51 4.9,30
  Top 0.457: 42.72,20.34 42.01,19.63
  Top 0.508: 34.34,21.15 v34.04,21.46 | v42.8,20.6 42.72,20.34 | TH1.P$2 v11.45,28.78 | v49.68,4.8 49.07,4.19 RG1.1 48.23,3.95 47.88,3.59 47.88,2.48 48.31,2.05 RG1.3
  Top 0.61: J1.4 45.76,19.55 v46.23,20.02
  Top 0.762: v49.73,20.02 53.42,20.02 57.17,16.26 C5.2 PN2.P$3 | 24.47,21.51 PN1.3 21.1,24.55 20.09,23.54 C1.1 | PN4_1(XB1).1 51.52,30.71 46.23,25.42 v46.23,25.3 | D1.- 22.87,21.45 HT1.P$3 | 7.36,24.87 15.29,24.87 16.64,24.87 17.97,23.54 C1.1 | C1.1 18.92,23.04 D1.-
  Top 0.813: v34.04,21.46 33.98,21.51 24.47,21.51 | 7.36,24.87 6.92,25.31 R239.7
  Bottom 0.305: v39.12,24.19 | v39.12,24.19 39.12,21.72 39.12,21.46
  Bottom 0.356: v11.45,28.77 11.35,28.87 11.35,31.81 11.6,32.05 14.31,32.05 14.55,31.81 14.55,29.54 v15.29,28.8
  Bottom 0.508: PN2.P$3 56.24,5.53 50.41,5.53 v49.68,4.8
  Bottom 0.762: v46.23,25.3 v46.23,20.02 | v34.04,21.46 39.12,21.46 | 39.12,21.72 41.68,21.72 v42.8,20.6 45.64,20.6 v46.23,20.02 | v49.73,20.02 v46.23,20.02
VREFA
  Top 0.254: AM1.17 | C6.2 41.31,25.4 41.31,25.02
  Top 0.356: 41.31,25.02 AM1.17
  Top 0.457: C6.2 41.28,25.45 42.49,26.66 43.28,26.66 L3.1

### Text on the board
tNames: ADC | 1 | 2 | 3 | GND | TX | RX | M-Logger vers. 3.1.2 / Togashi Lab. | VDD | GND | AM1 | - | OFF | ON | + | 2.0-3.0V | Rst | Cx | 1 | GND | VEL | GIO | GLB | 2